# Altium schematic sheet 2Reg.SchDoc
size A4
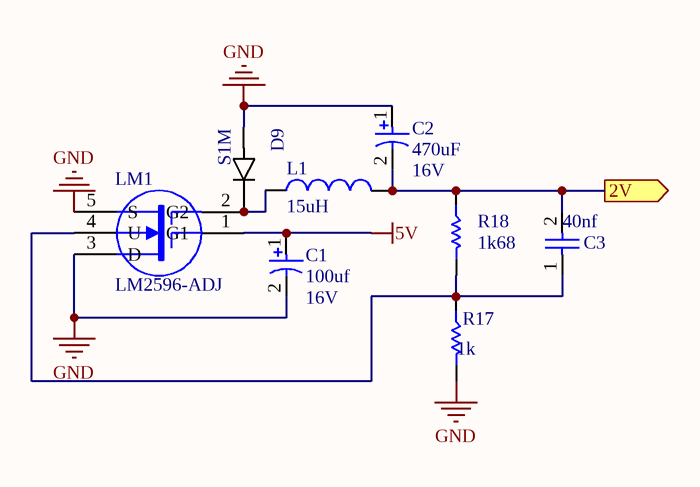
[diagram p0: 2Reg.SchDoc]

## Parts
C1  100uf  [RB5-10.5]
C2  470uF  [RB5-10.5]
C3  40nf  [6-0805_L]
D9  S1M  [*DIOM5227X270N_S1M(Primary)]
L1  15uH  [IND_SMD-13.0mm]
LM1  LM2596-ADJ  [T05A]
R17  1k  [6-0805_L]
R18  1k68  [6-0805_L]

## Ports
2V (out)

## Nets
5V: C1.1 LM1.1(G1)
GND: C1.2 C2.1 D9.A LM1.3(D) LM1.5(S) R17.2
2V: C2.2 C3.2 L1.2 R18.1 ; port 2V
NetC3_1: C3.1 LM1.4(U) R17.1 R18.2
NetD9_C: D9.C(K) L1.1 LM1.2(G2)

## Notes on the sheet
- Title
- Size:
- Date:
- A4
- Number:
- Time:
- Revision:
- Sheet
- of
- File:
- (in symbol CAP) 16V

## Library data of the parts
C1 C2 = CAP
C3 = CAP NON
D9 = S1M: S1 Series 1000 V 1 A 1 uA Surface Mount General Purpose Rectifier - DO-214AC; MF: ON Semiconductor; Price: None; Availability: Unavailable; SnapEDA_Link: https://www.snapeda.com/parts/S1M/ON%20Semiconductor/view-part/?ref=snap; Package: DO-214AC-214 ON Semiconductor; MP: S1M; Value: *
L1 = Inductor
LM1 = MOSFET-N3: Two-Gate, N-Channel MOSFET, Externally Terminated Substrate; Published: 24-Mar-1999; LatestRevisionDate: 17-Jul-2002; LatestRevisionNote: Re-released for DXP Platform.; PackageReference: T05A; Publisher: Altium Limited; PackageDescription: TO-220, Molded, 5 Lead, Straight; Code_JEDEC: TS-001-AA
R17 R18 = RESISTOR